# Altium schematic sheet RaspberryPi.SchDoc
size A4; SheetNumber: 4; SheetTotal: 8
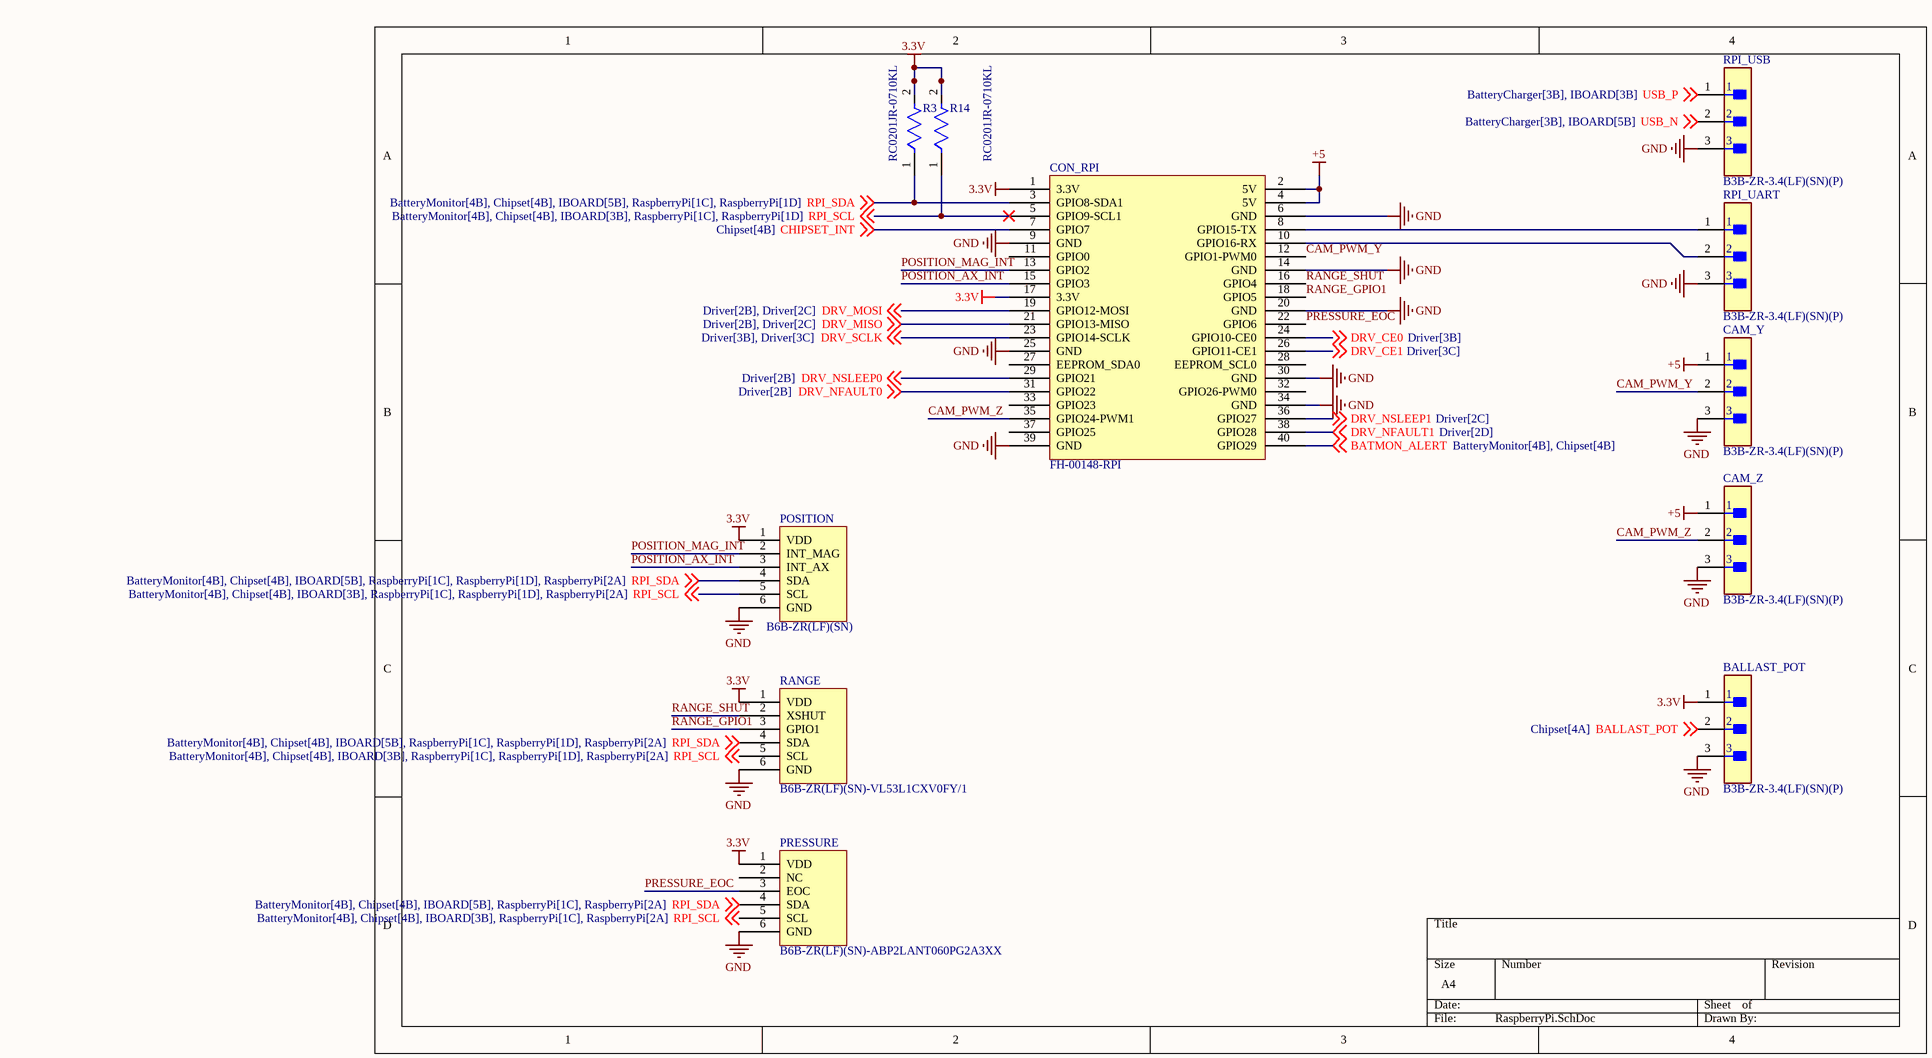
[diagram p0: RaspberryPi.SchDoc]

## Parts
BALLAST_POT  B3B-ZR-3.4(LF)(SN)(P)  [FP-B3B-ZR-3_4_LF_SN_P-MFG]
CAM_Y  B3B-ZR-3.4(LF)(SN)(P)  [FP-B3B-ZR-3_4_LF_SN_P-MFG]
CAM_Z  B3B-ZR-3.4(LF)(SN)(P)  [FP-B3B-ZR-3_4_LF_SN_P-MFG]
CON_RPI  FH-00148-RPI  [FH-00148]
POSITION  B6B-ZR(LF)(SN)  [B6B-ZR(LF)(SN)]
PRESSURE  B6B-ZR(LF)(SN)-ABP2LANT060PG2A3XX  [B6B-ZR(LF)(SN)]
R3  RC0201JR-0710KL  [FP-RC0201-0_26-IPC_C]
R14  RC0201JR-0710KL  [FP-RC0201-0_26-IPC_C]
RANGE  B6B-ZR(LF)(SN)-VL53L1CXV0FY/1  [B6B-ZR(LF)(SN)]
RPI_UART  B3B-ZR-3.4(LF)(SN)(P)  [FP-B3B-ZR-3_4_LF_SN_P-MFG]
RPI_USB  B3B-ZR-3.4(LF)(SN)(P)  [FP-B3B-ZR-3_4_LF_SN_P-MFG]

## Nets
3.3V: BALLAST_POT.1 CON_RPI.1(3.3V) CON_RPI.17(3.3V) POSITION.1(VDD) PRESSURE.1(VDD) R3.2 R14.2 RANGE.1(VDD)
+5: CAM_Y.1 CAM_Z.1 CON_RPI.2(5V) CON_RPI.4(5V)
GND: BALLAST_POT.3 CAM_Y.3 CAM_Z.3 CON_RPI.6(GND) CON_RPI.9(GND) CON_RPI.14(GND) CON_RPI.20(GND) CON_RPI.25(GND) CON_RPI.30(GND) CON_RPI.34(GND) CON_RPI.39(GND) POSITION.6(GND) PRESSURE.6(GND) RANGE.6(GND) RPI_UART.3 RPI_USB.3
BALLAST_POT: BALLAST_POT.2 ; off-sheet BALLAST_POT
BATMON_ALERT: CON_RPI.40(GPIO29) ; off-sheet BATMON_ALERT
CAM_PWM_Y: CAM_Y.2 CON_RPI.12(GPIO1-PWM0)
CAM_PWM_Z: CAM_Z.2 CON_RPI.35(GPIO24-PWM1)
CHIPSET_INT: CON_RPI.7(GPIO7) ; off-sheet CHIPSET_INT
DRV_CE0: CON_RPI.24(GPIO10-CE0) ; off-sheet DRV_CE0
DRV_CE1: CON_RPI.26(GPIO11-CE1) ; off-sheet DRV_CE1
DRV_MISO: CON_RPI.21(GPIO13-MISO) ; off-sheet DRV_MISO
DRV_MOSI: CON_RPI.19(GPIO12-MOSI) ; off-sheet DRV_MOSI
DRV_NFAULT0: CON_RPI.31(GPIO22) ; off-sheet DRV_NFAULT0
DRV_NFAULT1: CON_RPI.38(GPIO28) ; off-sheet DRV_NFAULT1
DRV_NSLEEP0: CON_RPI.29(GPIO21) ; off-sheet DRV_NSLEEP0
DRV_NSLEEP1: CON_RPI.36(GPIO27) ; off-sheet DRV_NSLEEP1
DRV_SCLK: CON_RPI.23(GPIO14-SCLK) ; off-sheet DRV_SCLK
POSITION_AX_INT: CON_RPI.15(GPIO3) POSITION.3(INT_AX)
POSITION_MAG_INT: CON_RPI.13(GPIO2) POSITION.2(INT_MAG)
PRESSURE_EOC: CON_RPI.22(GPIO6) PRESSURE.3(EOC)
RANGE_GPIO1: CON_RPI.18(GPIO5) RANGE.3(GPIO1)
RANGE_SHUT: CON_RPI.16(GPIO4) RANGE.2(XSHUT)
RPI_SCL: CON_RPI.5(GPIO9-SCL1) POSITION.5(SCL) PRESSURE.5(SCL) R14.1 RANGE.5(SCL) ; off-sheet RPI_SCL
RPI_SDA: CON_RPI.3(GPIO8-SDA1) POSITION.4(SDA) PRESSURE.4(SDA) R3.1 RANGE.4(SDA) ; off-sheet RPI_SDA
USB_N: RPI_USB.2 ; off-sheet USB_N
USB_P: RPI_USB.1 ; off-sheet USB_P
NetCON_RPI_8: CON_RPI.8(GPIO15-TX) RPI_UART.1
NetCON_RPI_10: CON_RPI.10(GPIO16-RX) RPI_UART.2

Not connected (* = marked no-connect by the designer): CON_RPI 11(GPIO0) 27(EEPROM_SDA0) 28(EEPROM_SCL0) 32(GPIO26-PWM0) 33(GPIO23) 37(GPIO25); PRESSURE 2(NC)

## Library data of the parts
BALLAST_POT CAM_Y CAM_Z RPI_UART RPI_USB = CMP-17439-000712-1: CONN HEADER VERT 3POS 1.5MM; Mated Stacking Heights: 5.6mm; Voltage Rating (AC): 50V; Number of Positions: 3; Number of Rows: 1; Connector Type: Header; Max Operating Temperature: 85°C; Min Operating Temperature: -25°C; Insulation Material: Nylon; Insulation Color: Natural; Contact Finish - Mating: TIN; Series: ZH; Packaging: Bulk; Contact Material: Brass; Fastening Type: Detent; Contact Shape: Circular; Contact Type: Male Pin; Flammability Rating: UL94 V-0; Mount: Through Hole; Termination: Press-Fit
POSITION = B6B-ZR(LF)(SN)-LSM303AGRTR
R3 R14 = CMP-03412-037826-1: RES SMD 10K OHM 5% 1/20W 0201; Voltage Rating: 25V; Max Power Dissipation: 50mW; Temperature Coefficient: 200ppm/°C; Resistance: 10kR; Min Operating Temperature: -55°C; Packaging: Tape and Reel; Tolerance: 5%; Length: 0.6mm; Contact Plating: Tin; Features: Moisture Resistant; Radiation Hardening: No; Military Standard: Not; Voltage Rating (DC): 25V; Termination: SMD/SMT; Size Code: 0201; Resistance Tolerance: 5%; Case Code (Imperial): 0201; Resistor Type: Thick Film; Depth: 0.3mm; Series: RC; Lead Free: Lead Free; Power Rating: 50mW; Number of Terminations: 2; Case Code (Metric): 0603; RoHS Compliant: Yes; Max Operating Temperature: 125°C; Construction: Rectangular; Case/Package: 0201